# Altium schematic sheet HomeController.SchDoc
size A4; SheetNumber: 1; SheetTotal: 4
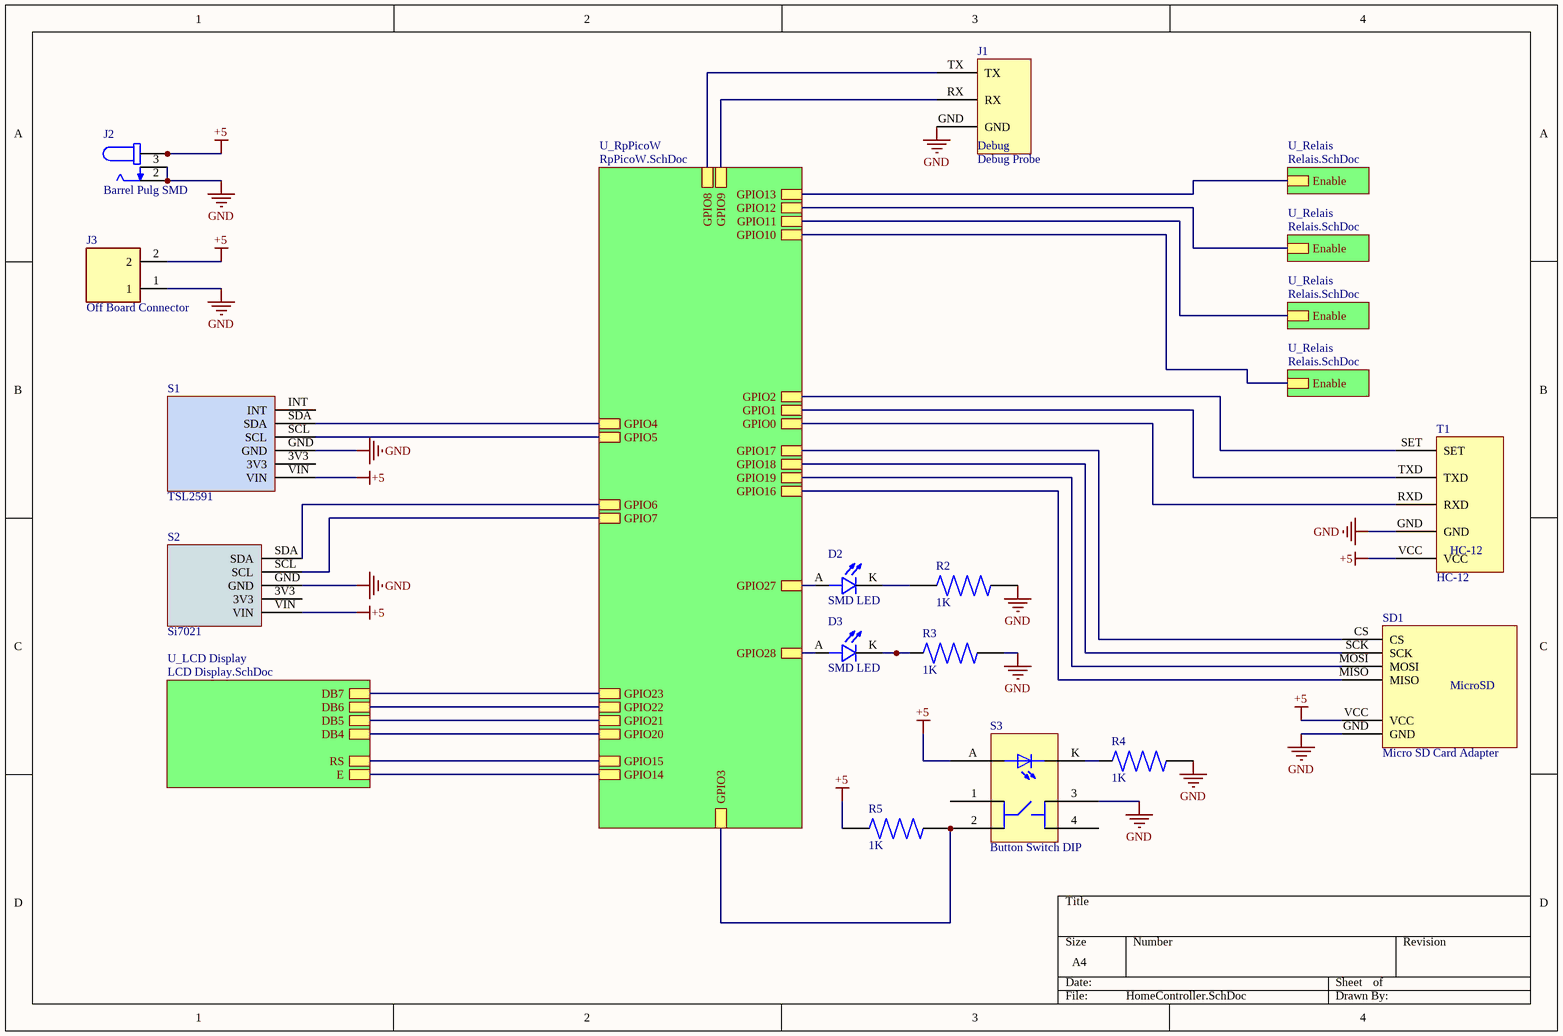
[diagram p0: HomeController.SchDoc]

## Parts
D2  SMD LED  [SMD LED-Footprint-1]
D3  SMD LED  [SMD LED-Footprint-1]
J1  Debug Probe  [Debug Probe-Footprint-1]
J2  Barrel Pulg SMD  [Barrel Pulg SMD-Footprint-1]
J3  Off Board Connector  [Off Board Connector-Footprint-1]
R2  1K  [SMD Resistor-Footprint-1]
R3  1K  [SMD Resistor-Footprint-1]
R4  1K  [SMD Resistor-Footprint-1]
R5  1K  [SMD Resistor-Footprint-1]
S1  TSL2591  [TSL2591-Footprint-1]
S2  Si7021  [Si7021-Footprint-1]
S3  Button Switch DIP  [Button Switch DIP -Footprint-1]
SD1  Micro SD Card Adapter  [Micro SD Card Adapter-Footprint-1]
T1  HC-12  [HC-12-Footprint-1]

## Sub-sheets
U_LCD Display = LCD Display.SchDoc: DB7, DB6, DB5, DB4, RS, E
U_Relais = Relais.SchDoc: Enable
U_Relais = Relais.SchDoc: Enable
U_Relais = Relais.SchDoc: Enable
U_Relais = Relais.SchDoc: Enable
U_RpPicoW = RpPicoW.SchDoc: GPIO0, GPIO1, GPIO2, GPIO3, GPIO4, GPIO5, GPIO6, GPIO7, GPIO8, GPIO9, GPIO10, GPIO11, GPIO12, GPIO13, GPIO14, GPIO15, GPIO16, GPIO17, GPIO18, GPIO19, GPIO20, GPIO21, GPIO22, GPIO23, GPIO27, GPIO28

## Nets
+5: J2.1A J2.1B J3.2 R5.1 S1.VIN S2.VIN S3.A SD1.VCC T1.VCC
GND: J1.GND J2.2 J2.3 J3.1 R2.2 R3.2 R4.2 S1.GND S2.GND S3.3 SD1.GND T1.GND
NetD2_A: D2.A ; sheet U_RpPicoW/GPIO27
NetD2_K: D2.K(C) R2.1
NetD3_A: D3.A ; sheet U_RpPicoW/GPIO28
NetD3_K: D3.K(C) R3.1
NetJ1_RX: J1.RX ; sheet U_RpPicoW/GPIO9
NetJ1_TX: J1.TX ; sheet U_RpPicoW/GPIO8
NetR4_1: R4.1 S3.K
NetR5_2: R5.2 S3.2 ; sheet U_RpPicoW/GPIO3
NetS1_SCL: S1.SCL ; sheet U_RpPicoW/GPIO5
NetS1_SDA: S1.SDA ; sheet U_RpPicoW/GPIO4
NetS2_SCL: S2.SCL ; sheet U_RpPicoW/GPIO7
NetS2_SDA: S2.SDA ; sheet U_RpPicoW/GPIO6
NetSD1_CS: SD1.CS ; sheet U_RpPicoW/GPIO17
NetSD1_MISO: SD1.MISO ; sheet U_RpPicoW/GPIO16
NetSD1_MOSI: SD1.MOSI ; sheet U_RpPicoW/GPIO19
NetSD1_SCK: SD1.SCK ; sheet U_RpPicoW/GPIO18
NetT1_RXD: T1.RXD ; sheet U_RpPicoW/GPIO0
NetT1_SET: T1.SET ; sheet U_RpPicoW/GPIO2
NetT1_TXD: T1.TXD ; sheet U_RpPicoW/GPIO1
(unnamed): sheet U_RpPicoW/GPIO10, sheet U_Relais/Enable
(unnamed): sheet U_RpPicoW/GPIO11, sheet U_Relais/Enable
(unnamed): sheet U_RpPicoW/GPIO12, sheet U_Relais/Enable
(unnamed): sheet U_RpPicoW/GPIO13, sheet U_Relais/Enable
(unnamed): sheet U_RpPicoW/GPIO14, sheet U_LCD Display/E
(unnamed): sheet U_RpPicoW/GPIO15, sheet U_LCD Display/RS
(unnamed): sheet U_RpPicoW/GPIO20, sheet U_LCD Display/DB4
(unnamed): sheet U_RpPicoW/GPIO21, sheet U_LCD Display/DB5
(unnamed): sheet U_RpPicoW/GPIO22, sheet U_LCD Display/DB6
(unnamed): sheet U_RpPicoW/GPIO23, sheet U_LCD Display/DB7

Not connected (* = marked no-connect by the designer): S1 3V3 INT; S2 3V3; S3 1 4

## Notes on the sheet
- (in symbol CMP-00026-2) Debug
- (in symbol CMP-00032-2) MicroSD

## Library data of the parts
D2 D3 = CMP-00018-2: Generic SMD LED
J1 = CMP-00026-2: A Connector for the Debug Probe
J2 = CMP-00004-1: SMD Barrel Plug
J3 = CMP-00011-1: 2 Pin
R2-R5 = CMP-00019-2: Generic SMD Resistor
S1 = CMP-00037-1: Adafruit High Dynamic Range Digital Light Sensor
S2 = CMP-00038-1: Adafruit Si7021 Temperature & Humidity Sensor
S3 = CMP-00006-1: 6 Pin with LED
SD1 = CMP-00032-2: SD Card Break Out Board
T1 = CMP-00027-2: UART Telemetry Antenna